# Altium schematic sheet Main.SchDoc
size B; Organization: Altium Limited; Address1: L3, 12a Rodborough Rd; Address2: Frenchs Forest; Address3: NSW; Address4: Australia 2086
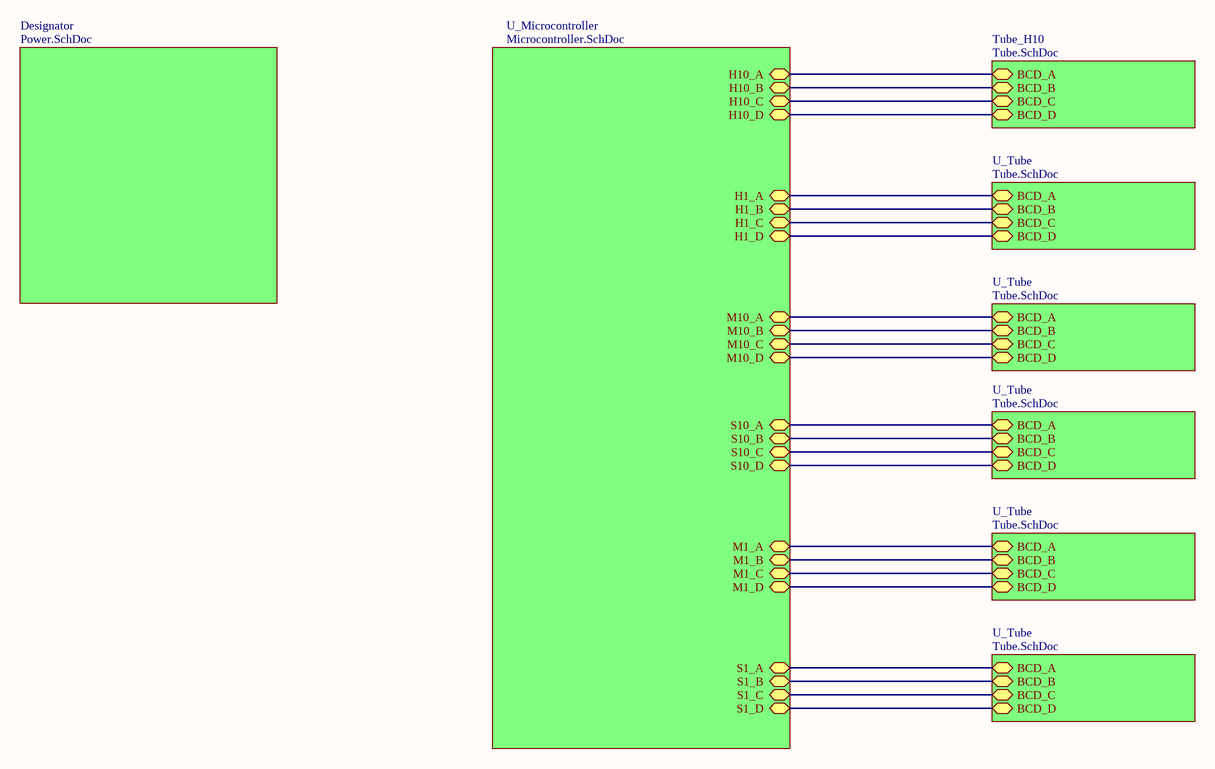
[diagram p0: Main.SchDoc]

## Sub-sheets
Designator = Power.SchDoc: no entries
Tube_H10 = Tube.SchDoc: BCD_A, BCD_B, BCD_C, BCD_D
U_Microcontroller = Microcontroller.SchDoc: H10_A, H10_B, H10_C, H10_D, H1_A, H1_B, H1_C, H1_D, M10_A, M10_B, M10_C, M10_D, S10_A, S10_B, S10_C, S10_D, M1_A, M1_B, M1_C, M1_D, S1_A, S1_B, S1_C, S1_D
U_Tube = Tube.SchDoc: BCD_A, BCD_B, BCD_C, BCD_D
U_Tube = Tube.SchDoc: BCD_A, BCD_B, BCD_C, BCD_D
U_Tube = Tube.SchDoc: BCD_A, BCD_B, BCD_C, BCD_D
U_Tube = Tube.SchDoc: BCD_A, BCD_B, BCD_C, BCD_D
U_Tube = Tube.SchDoc: BCD_A, BCD_B, BCD_C, BCD_D

## Nets
(unnamed): sheet U_Microcontroller/H10_A, sheet Tube_H10/BCD_A
(unnamed): sheet U_Microcontroller/H10_B, sheet Tube_H10/BCD_B
(unnamed): sheet U_Microcontroller/H10_C, sheet Tube_H10/BCD_C
(unnamed): sheet U_Microcontroller/H10_D, sheet Tube_H10/BCD_D
(unnamed): sheet U_Microcontroller/H1_A, sheet U_Tube/BCD_A
(unnamed): sheet U_Microcontroller/H1_B, sheet U_Tube/BCD_B
(unnamed): sheet U_Microcontroller/H1_C, sheet U_Tube/BCD_C
(unnamed): sheet U_Microcontroller/H1_D, sheet U_Tube/BCD_D
(unnamed): sheet U_Microcontroller/M10_A, sheet U_Tube/BCD_A
(unnamed): sheet U_Microcontroller/M10_B, sheet U_Tube/BCD_B
(unnamed): sheet U_Microcontroller/M10_C, sheet U_Tube/BCD_C
(unnamed): sheet U_Microcontroller/M10_D, sheet U_Tube/BCD_D
(unnamed): sheet U_Microcontroller/S10_A, sheet U_Tube/BCD_A
(unnamed): sheet U_Microcontroller/S10_B, sheet U_Tube/BCD_B
(unnamed): sheet U_Microcontroller/S10_C, sheet U_Tube/BCD_C
(unnamed): sheet U_Microcontroller/S10_D, sheet U_Tube/BCD_D
(unnamed): sheet U_Microcontroller/M1_A, sheet U_Tube/BCD_A
(unnamed): sheet U_Microcontroller/M1_B, sheet U_Tube/BCD_B
(unnamed): sheet U_Microcontroller/M1_C, sheet U_Tube/BCD_C
(unnamed): sheet U_Microcontroller/M1_D, sheet U_Tube/BCD_D
(unnamed): sheet U_Microcontroller/S1_A, sheet U_Tube/BCD_A
(unnamed): sheet U_Microcontroller/S1_B, sheet U_Tube/BCD_B
(unnamed): sheet U_Microcontroller/S1_C, sheet U_Tube/BCD_C
(unnamed): sheet U_Microcontroller/S1_D, sheet U_Tube/BCD_D

## Notes on the sheet
- Title
- Size:
- Date:
- B
- Number:
- Time:
- Revision:
- Sheet
- of
- File: